# Altium schematic sheet MCU_REVB_3.SchDoc: Big-MCU
size 270 x 223 mm; Origin: Eagle; Date: 2023-01-13 8:42:14 AM; SheetNumber: 4; GateName_1: G$1; SymbolName_1: LETTER_L; LibraryName: frames; DeviceSetName: LETTER_L; GateName_2: G$2; SymbolName_2: DOCFIELD; Sheet: Sheet:; REV: REV:
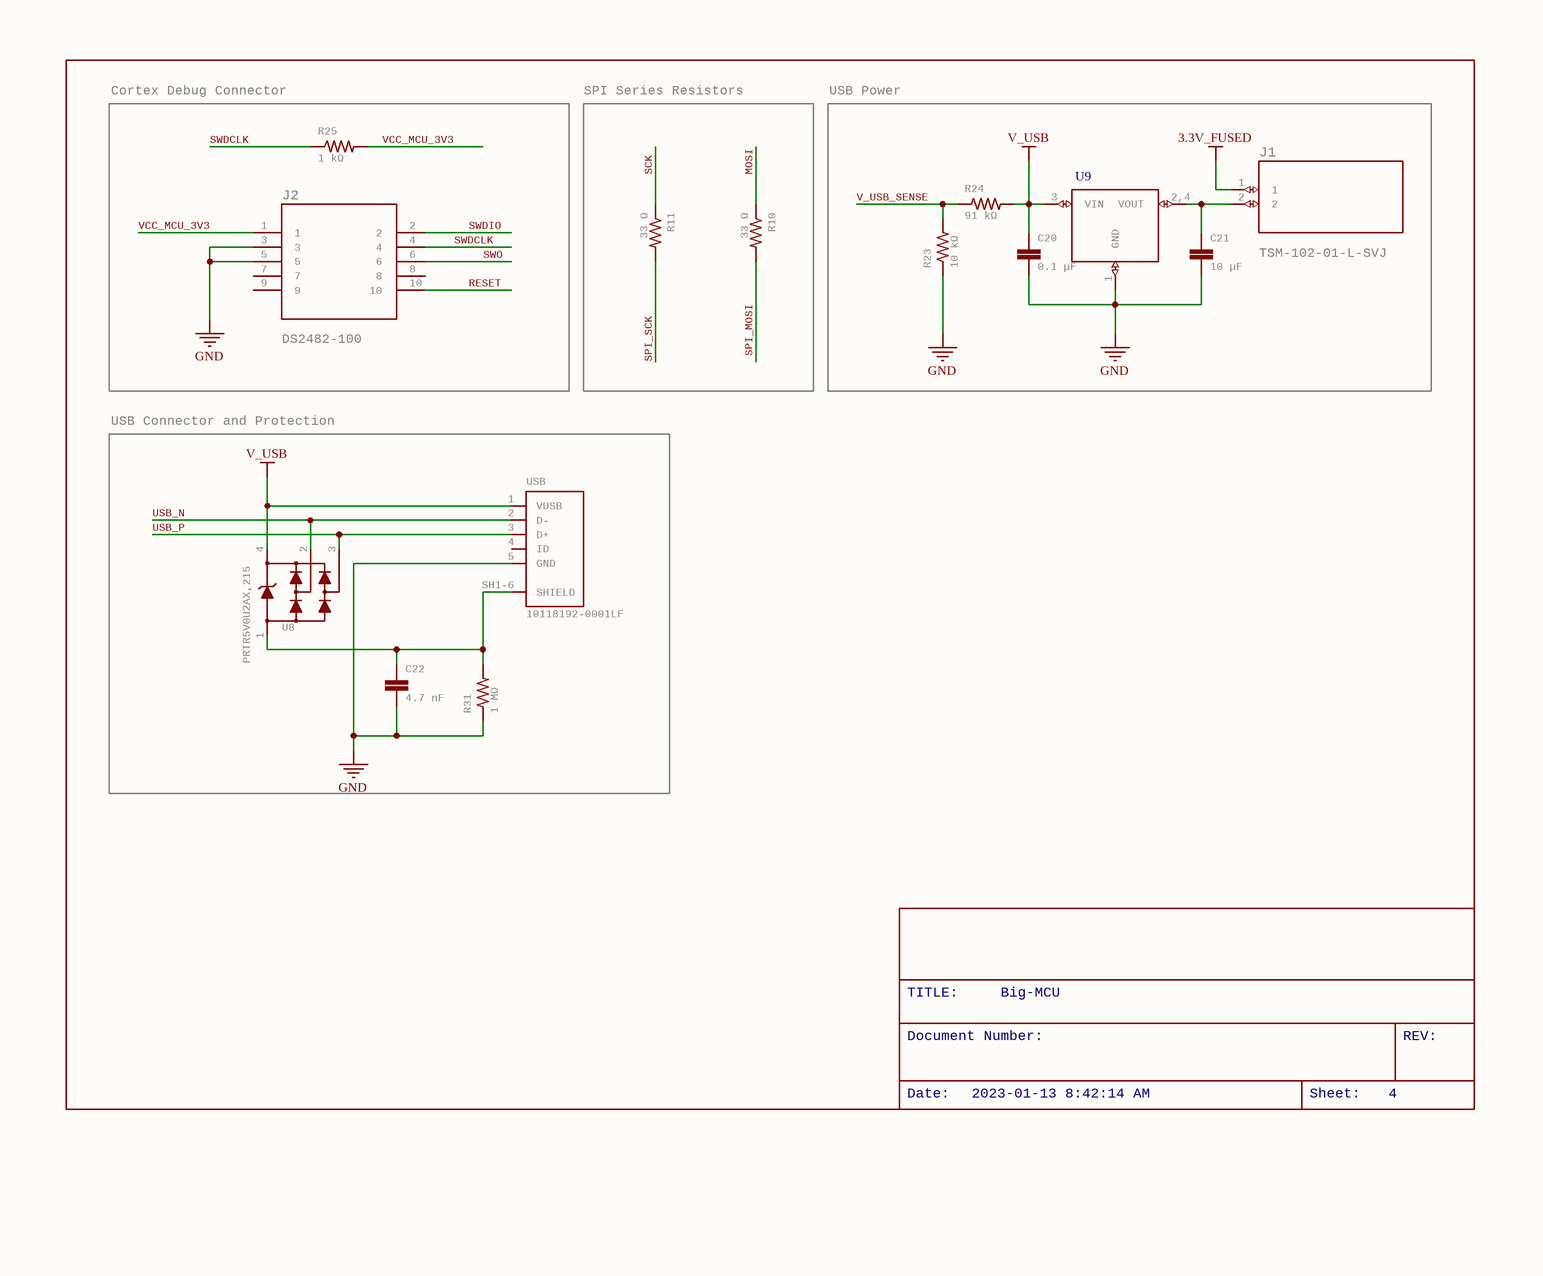
[diagram p0: MCU_REVB_3.SchDoc]

## Parts
C20  0.1 µF  [C0805]
C21  10 µF  [C1206]
C22  4.7 nF  [C0805]
J1  TSM-102-01-L-SVJ  [FP-TSM-102-01-L-SV-P-TR-MFG]
J2  DS2482-100  [SAMTEC-FTSH-105-01-X-DV]
R10  33 Ω  [6-0805_N]
R11  33 Ω  [6-0805_N]
R23  10 kΩ  [6-0805_N]
R24  91 kΩ  [6-0805_N]
R25  1 kΩ  [6-0805_N]
R31  1 MΩ  [6-0805_N]
U8  PRTR5V0U2AX,215  [FP-SOT143B-MFG]
U9  LDL1117S33R  [FP-SOT223-0046067-IPC_B]  (value not drawn)
USB  10118192-0001LF  [FCI-10118192-0001LF-5_V]

## Blocks framed on the sheet
Cortex Debug Connector: J2 R25
SPI Series Resistors: R10 R11
USB Power: C20 C21 J1 R23 R24 U9
USB Connector and Protection: C22 R31 U8 USB

## Nets
3.3V_FUSED: J1.1
GND: C20.2 C21.2 C22.2 J2.3 J2.5 R23.1 R31.1 U9.1(GND) USB.5(GND)
V_USB: C20.1 R24.2 U8.4(P$4) U9.3(VIN) USB.1(VUSB)
MOSI: R10.1
RESET: J2.10
SCK: R11.1
SPI_MOSI: R10.2
SPI_SCK: R11.2
SWDCLK: J2.4 R25.1
SWDIO: J2.2
SWO: J2.6
USB_N: U8.2(P$2) USB.2(D-)
USB_P: U8.3(P$3) USB.3(D+)
V_USB_SENSE: R23.2 R24.1
VCC_MCU_3V3: J2.1 R25.2
NetC21_1: C21.1 J1.2 U9.2,4(VOUT)
NetC22_1: C22.1 R31.2 U8.1(P$1) USB.SH1-6(SHIELD)

Not connected (* = marked no-connect by the designer): J2 7 8 9; USB 4(ID)

## Notes on the sheet
- TITLE:
- Big-MCU
- Document Number:
- REV:
- Date:
- 2023-01-13 8:42:14 AM
- Sheet:
- 4

## Library data of the parts
C20 C22 = C-EUC0805: CAPACITOR, European symbol; GateName_1: G$1; SymbolName_1: C-EU; POPULARITY: 88; DeviceName: C0805; LibraryName: rcl; DeviceSetName: C-EU; SPICEPREFIX: C
C21 = C-EUC1206: CAPACITOR, European symbol; GateName_1: G$1; SymbolName_1: C-EU; POPULARITY: 54; DeviceName: C1206; LibraryName: rcl; DeviceSetName: C-EU; SPICEPREFIX: C
J1 = CMP-006-000025-2: Conn Unshrouded Header HDR 2 POS 2.54mm Solder ST Top Entry SMD T/R; GateName_1: A; SymbolName_1: TSM-102-01-L-SVA; DeviceName: J; MF: Samtec; Number of Contacts: 2; Max Voltage Rating (AC): 475V; Gender: Male; Max Current Rating: 7A; LibraryName: MCU Board; DeviceSetName: TSM-102-01-L-SV; DIGI-KEY_PART_NUMBER: SAM14923TR-ND; MP: TSM-102-01-L-SV; Package: TSM-102-01-L-SV; TOBY_UK-PURCHASE-URL: https://snapeda.com/shop?store=Toby+UK&id=2748087; Pin Count: 2; Source: MCU Board.SCHLIB; Component Type: Standard; Design Item ID: TSM-102-01-L-SVJ; Packaging: Tape and Reel; Number of Rows: 1; Pitch: 2.54mm; Reach SVHC Compliant: Yes; Housing Color: Black; Max Operating Temperature: 125°C; Radiation Hardening: No; Lead Free: Lead Free; Housing Material: Polymer; Contact Plating: Gold; Termination: Solder; Contact Material: Bronze; Orientation: Straight; Length: 5.08mm; Depth: 2.54mm; Min Operating Temperature: -55°C; RoHS Compliant: Yes
J2 = CMP-006-000020-2: Conn Unshrouded Header HDR 10 POS 1.27mm Solder ST Top Entry SMD Tube; GateName_1: A; SymbolName_1: SAMTEC-FTSH-105-01-X-DVA; DeviceName: J; Current Rating: 1.75A; Connector Type: Male Pin; Number of Positions: 10; Gender: Male; Row Spacing: 0.05inch; LibraryName: MCU Board; DeviceSetName: SAMTEC-FTSH-105-01-X-DV; Design Item ID: SAMTEC-FTSH-105-01-X-DVJ; Component Type: Standard; Package Quantity: 1; Housing Material: Polymer; Max Operating Temperature: 125°C; Packaging: Bulk; Package: SAMTEC-FTSH-105-01-X-DV; Orientation: Straight; Housing Color: Black; Lead Free: Lead Free; Depth: 3.43mm; Min Operating Temperature: -55°C; Mounting Technology: Surface Mount; Length: 6.35mm; Pin Count: 10; Termination: Solder; Reach SVHC Compliant: Yes; Source: MCU Board.SCHLIB; Color: Black; Contact Plating: Gold; Contact Material: Bronze; Pitch: 1.27mm; Max Current Rating: 1.75A; Contact Type: Male Pin; Series: FTSH; Number of Rows: 2; Number of Contacts: 10; Contact Mating Length: 0.12inch; RoHS Compliant: Yes
R10 R11 R23-R25 R31 = R-US_R0805: RESISTOR, American symbol; GateName_1: G$1; SymbolName_1: R-US; DeviceName: R0805; DeviceSetName: R-US_; POPULARITY: 85; LibraryName: rcl; SPICEPREFIX: R
U8 = CMP-003-000007-2: TVS DIODE 5.5VWM SOT143B; GateName_1: G$1; SymbolName_1: PRTR5V0U2X_215; LibraryName: MCU Board; DeviceSetName: PRTR5V0U2X_215; Pin Count: 4; Component Type: Standard; Source: MCU Board.SCHLIB; Design Item ID: PRTR5V0U2X_215; Package: SOT143B
U9 = CMP-006-000017-2: 1.2AHIGHPSRRLOWDROPOUTLINE; pin to pad: 2,4>2+4; GateName_1: G$1; Min Input Voltage: 2.5V; Min Output Voltage: 3.3V; Output Configuration: Positive; Dropout Voltage: 350mV; Number of Outputs: 1; Power Supply Rejection Ratio (PSRR): 65dB; Quiescent Current: 250uA; Output Current: 1.2A; Output Type: Fixed; Max Supply Voltage: 18V; SymbolName_1: LDL1117; LibraryName: MCU Board; DeviceSetName: LDL1117S33R; Design Item ID: LDL1117S33R; Package: SOT223; Pin Count: 3; Source: MCU Board.SCHLIB; Component Type: Standard; Case/Package: SOT-223-4; Weight: 0.009171oz; RoHS Compliant: Yes; Min Operating Temperature: -40°C; Mounting Technology: Surface Mount; Package Quantity: 2500; Packaging: Tape and Reel; Output Voltage: 3.3V; Max Operating Temperature: 125°C; Series: LDL1117; Number of Regulators: 1
USB = CMP-006-000000-3: CONN USB MICRO B RECPT SMT R/A; pin to pad: SH1-6>6+7+8+9+10+11; GateName_1: G$1; SymbolName_1: 10118192-0001LF; LibraryName: MCU Board; DeviceSetName: 10118192-0001LF; Source: MCU Board.SCHLIB; Component Type: Standard; Pin Count: 6; Design Item ID: 10118192-0001LF; Package: 10118192-0001LF